# Altium schematic sheet Uproject.SchDoc
size A3; SheetNumber: 2; SheetTotal: 2
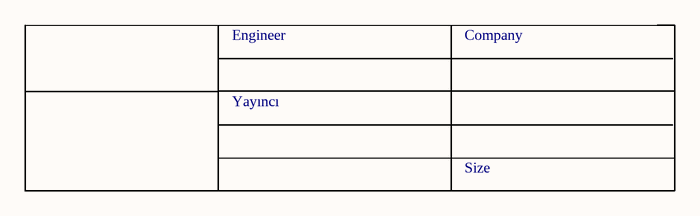
[diagram p0: Uproject.SchDoc]

## Notes on the sheet
- Engineer
- Company
- Yayıncı
- Size